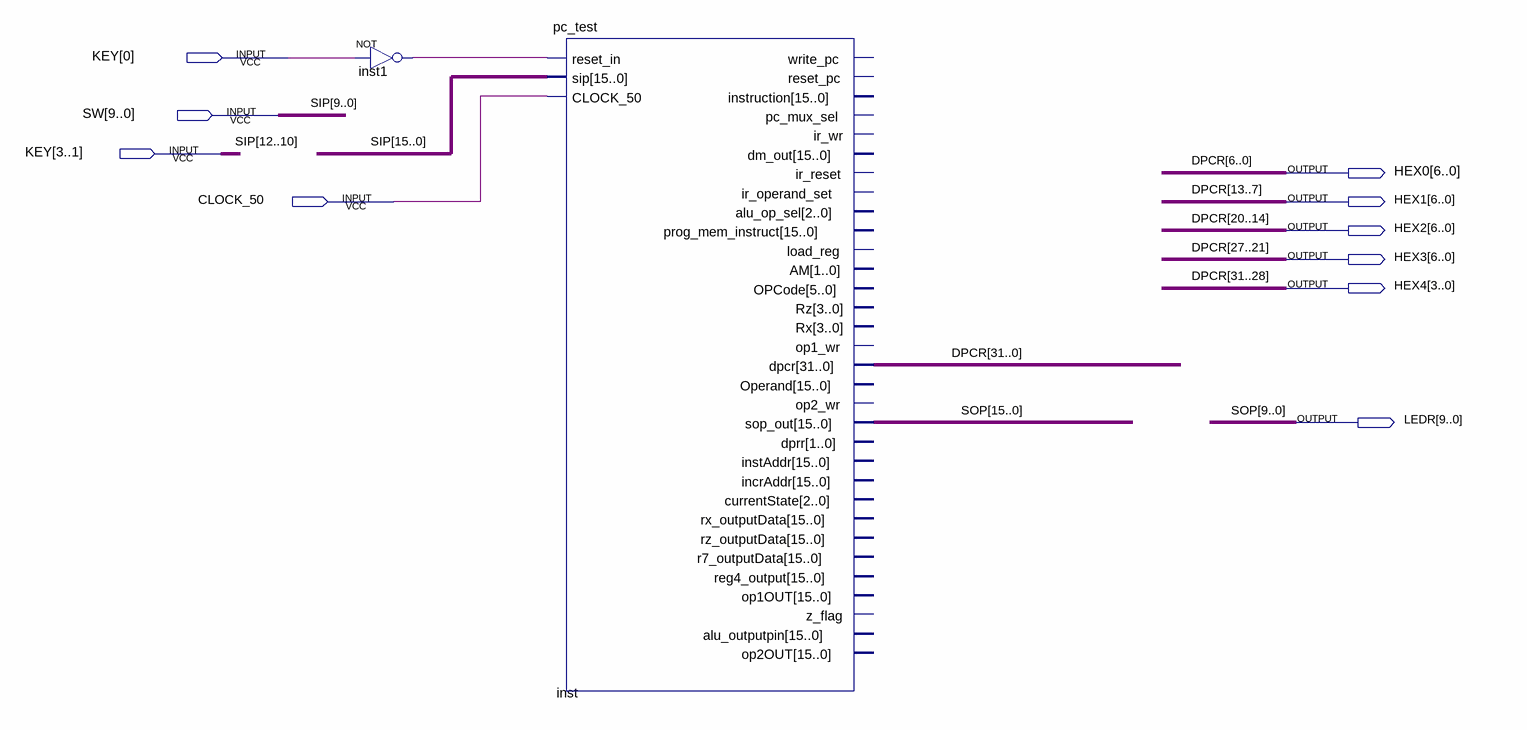
[diagram p0: schematic sheet]
// Quartus schematic TopLevel.bdf as structural Verilog: 2 symbols, 10 pins
module TopLevel (
  input  [3:0] KEY,
  input  [9:0] SW,
  input  CLOCK_50,
  output [6:0] HEX0,
  output [6:0] HEX1,
  output [6:0] HEX2,
  output [6:0] HEX3,
  output [3:0] HEX4,
  output [9:0] LEDR
);

  wire inst1_out;
  wire [15:10] SOP;
  wire [15:13] SIP;

  not inst1 (inst1_out, KEY[0]);
  pc_test inst (
    .reset_in(inst1_out), .sip({SIP, KEY[3:1], SW}), .CLOCK_50(CLOCK_50),
    .dpcr({HEX4, HEX3, HEX2, HEX1, HEX0}), .sop_out({SOP, LEDR}));  // open: write_pc, reset_pc, instruction, pc_mux_sel, ir_wr, dm_out, ir_reset, ir_operand_set, alu_op_sel, prog_mem_instruct, load_reg, AM, OPCode, Rz, Rx, op1_wr, Operand, op2_wr, dprr, instAddr, incrAddr, currentState, rx_outputData, rz_outputData, r7_outputData, reg4_output, op1OUT, z_flag, alu_outputpin, op2OUT

  // Other names for the same wires on the sheet: DPCR[31:0] = {HEX4, HEX3, HEX2, HEX1, HEX0};
  //   SIP[12:0] = {KEY[3:1], SW}; SOP[9:0] = LEDR
endmodule
